# Altium schematic sheet SH22 - AIC3106.SchDoc
size 386 x 246 mm
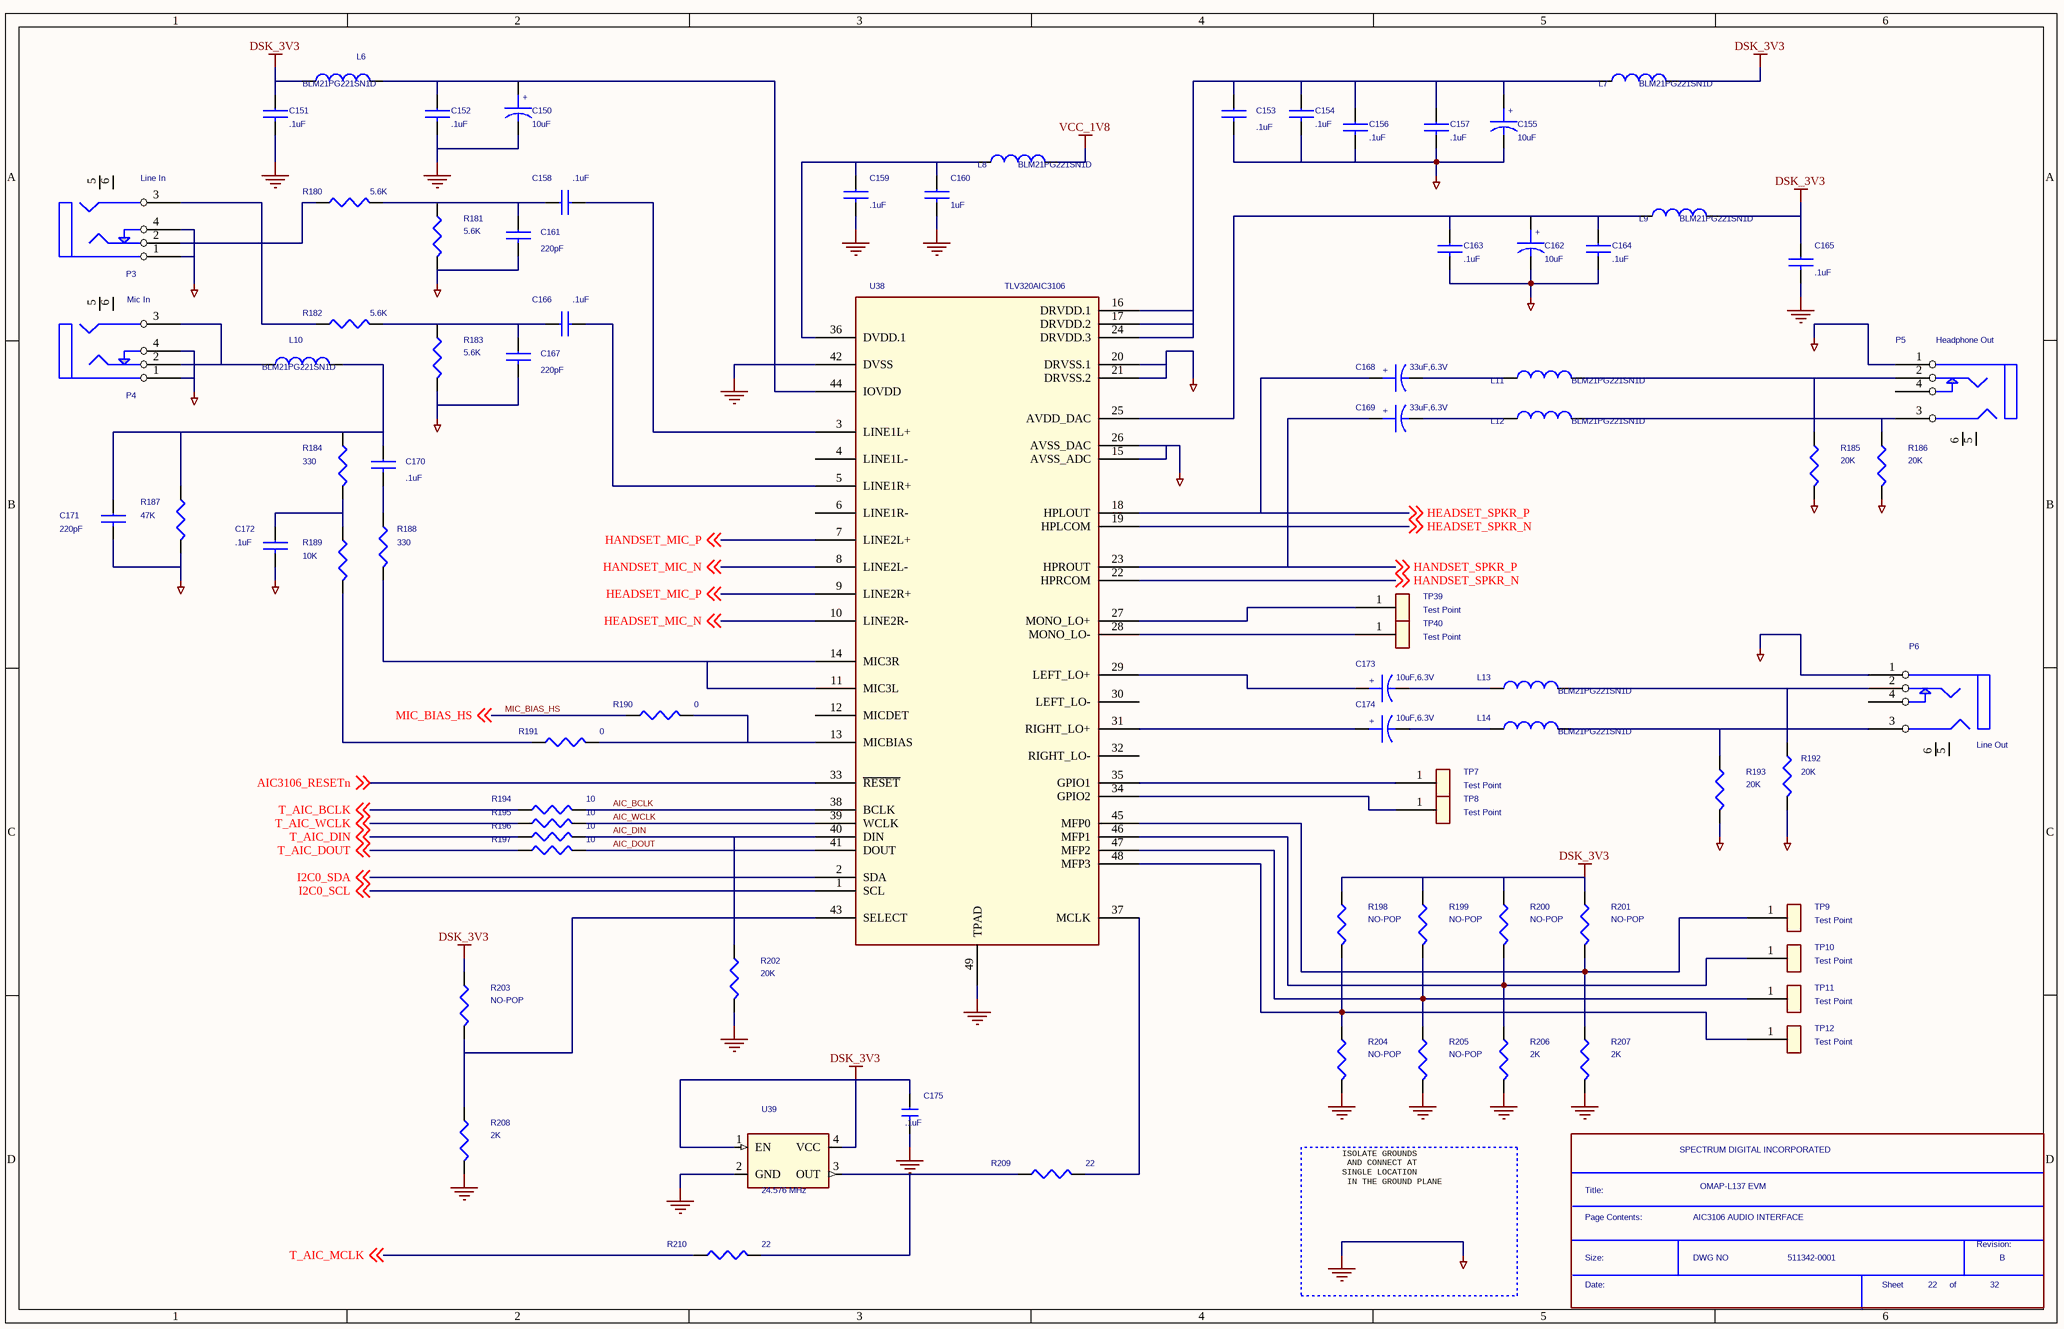
[diagram p0: SH22 - AIC3106.SchDoc]

## Parts
*  Page Contents:: AIC3106 AUDIO INTERFACE  RevCode: B  Title: OMAP-L137 EVM  OrgName: SPECTRUM DIGITAL INCORPORATED  Doc: 511342-0001  Page Number: 22  Page Count: 32  (hidden comment: SDTitleBlock)  (graphical)
C150  10uF  [c1206-40x70-POL]
C151  .1uF  [c402-25]
C152  .1uF  [c402-25]
C153  .1uF  [c402-25]
C154  .1uF  [c402-25]
C155  10uF  [c1206-40x70-POL]
C156  .1uF  [c402-25]
C157  .1uF  [c402-25]
C158  .1uF  [c402-25]
C159  .1uF  [c402-25]
C160  1uF  [c603-35x45]
C161  220pF  [c603-35x45]
C162  10uF  [c1206-40x70-POL]
C163  .1uF  [c402-25]
C164  .1uF  [c402-25]
C165  .1uF  [c402-25]
C166  .1uF  [c402-25]
C167  220pF  [c603-35x45]
C168  33uF,6.3V  [c1206-40x70p]
C169  33uF,6.3V  [c1206-40x70p]
C170  .1uF  [c402-25]
C171  220pF  [c603-35x45]
C172  .1uF  [c402-25]
C173  10uF,6.3V  [c1206-40x70-POL]
C174  10uF,6.3V  [c1206-40x70-POL]
C175  .1uF  [c402-25]
L6  BLM21PG221SN1D  [l805-35x60]
L7  BLM21PG221SN1D  [l805-35x60]
L8  BLM21PG221SN1D  [l805-35x60]
L9  BLM21PG221SN1D  [l805-35x60]
L10  BLM21PG221SN1D  [l805-35x60]
L11  BLM21PG221SN1D  [l805-35x60]
L12  BLM21PG221SN1D  [l805-35x60]
L13  BLM21PG221SN1D  [l805-35x60]
L14  BLM21PG221SN1D  [l805-35x60]
P3  Line In  [st_3500]
P4  Mic In  [st_3500]
P5  Headphone Out  [st_3500]
P6  Line Out  [st_3500]
R180  5.6K  [r603-35x45]
R181  5.6K  [r603-35x45]
R182  5.6K  [r603-35x45]
R183  5.6K  [r603-35x45]
R184  330  [r402-25]
R185  20K  [r402-25]
R186  20K  [r402-25]
R187  47K  [r402-25]
R188  330  [r402-25]
R189  10K  [r402-25]
R190  0  [r402-25]
R191  0  [r402-25]
R192  20K  [r402-25]
R193  20K  [r402-25]
R194  10  [r402-25]
R195  10  [r402-25]
R196  10  [r402-25]
R197  10  [r402-25]
R198  NO-POP  [r402-25]
R199  NO-POP  [r402-25]
R200  NO-POP  [r402-25]
R201  NO-POP  [r402-25]
R202  20K  [r402-25]
R203  NO-POP  [r402-25]
R204  NO-POP  [r402-25]
R205  NO-POP  [r402-25]
R206  2K  [r402-25]
R207  2K  [r402-25]
R208  2K  [r402-25]
R209  22  [r402-25]
R210  22  [r402-25]
TP7  Test Point  [tp1-6040]
TP8  Test Point  [tp1-6040]
TP9  Test Point  [tp1-6040]
TP10  Test Point  [tp1-6040]
TP11  Test Point  [tp1-6040]
TP12  Test Point  [tp1-6040]
TP39  Test Point  [tp1-6040]
TP40  Test Point  [tp1-6040]
U38  TLV320AIC3106  [rgz48-11x34]
U39  24.576 MHz  [xtal4-70x78-ctx]

## Nets
DSK_3V3: C151.1 C165.1 C175.1 L6.1 L7.2 L9.2 R198.1 R199.1 R200.1 R201.1 R203.1 U39.1(EN) U39.4(VCC)
GND: C150.2 C151.2 C152.2 C153.2 C154.2 C155.2 C156.2 C157.2 C159.2 C160.2 C161.2 C162.2 C163.2 C164.2 C165.2 C167.2 C171.2 C172.2 C175.2 P3.1(SHIELD) P3.4(TIPB) P4.1(SHIELD) P4.4(TIPB) P5.1(SHIELD) P6.1(SHIELD) R181.2 R183.2 R185.2 R186.2 R187.2 R192.2 R193.2 R202.2 R204.2 R205.2 R206.2 R207.2 R208.2 U38.15(AVSS_ADC) U38.20(DRVSS.1) U38.21(DRVSS.2) U38.26(AVSS_DAC) U38.42(DVSS) U38.49(TPAD) U39.2(GND)  [also labelled GND_AIC]
VCC_1V8: L8.2
AIC3106_RESETn: U38.33(~{RESET}) ; off-sheet AIC3106_RESETn
AIC_BCLK: R194.2 U38.38(BCLK)
AIC_DIN: R196.2 R202.1 U38.40(DIN)
AIC_DOUT: R197.2 U38.41(DOUT)
AIC_WCLK: R195.2 U38.39(WCLK)
HANDSET_MIC_N: U38.8(LINE2L-) ; off-sheet HANDSET_MIC_N
HANDSET_MIC_P: U38.7(LINE2L+) ; off-sheet HANDSET_MIC_P
HANDSET_SPKR_N: U38.22(HPRCOM) ; off-sheet HANDSET_SPKR_N
HANDSET_SPKR_P: C169.1 U38.23(HPROUT) ; off-sheet HANDSET_SPKR_P
HEADSET_MIC_N: U38.10(LINE2R-) ; off-sheet HEADSET_MIC_N
HEADSET_MIC_P: U38.9(LINE2R+) ; off-sheet HEADSET_MIC_P
HEADSET_SPKR_N: U38.19(HPLCOM) ; off-sheet HEADSET_SPKR_N
HEADSET_SPKR_P: C168.1 U38.18(HPLOUT) ; off-sheet HEADSET_SPKR_P
I2C0_SCL: U38.1(SCL) ; off-sheet I2C0_SCL
I2C0_SDA: U38.2(SDA) ; off-sheet I2C0_SDA
MIC_BIAS_HS: R190.1 ; off-sheet MIC_BIAS_HS
T_AIC_BCLK: R194.1 ; off-sheet T_AIC_BCLK
T_AIC_DIN: R196.1 ; off-sheet T_AIC_DIN
T_AIC_DOUT: R197.1 ; off-sheet T_AIC_DOUT
T_AIC_MCLK: R210.1 ; off-sheet T_AIC_MCLK
T_AIC_WCLK: R195.1 ; off-sheet T_AIC_WCLK
NetC150_1: C150.1 C152.1 L6.2 U38.44(IOVDD)
NetC153_1: C153.1 C154.1 C155.1 C156.1 C157.1 L7.1 U38.16(DRVDD.1) U38.17(DRVDD.2) U38.24(DRVDD.3)
NetC158_1: C158.1 C161.1 R180.2 R181.1
NetC158_2: C158.2 U38.3(LINE1L+)
NetC159_1: C159.1 C160.1 L8.1 U38.36(DVDD.1)
NetC162_1: C162.1 C163.1 C164.1 L9.1 U38.25(AVDD_DAC)
NetC166_1: C166.1 C167.1 R182.2 R183.1
NetC166_2: C166.2 U38.5(LINE1R+)
NetC168_2: C168.2 L11.1
NetC169_2: C169.2 L12.1
NetC170_1: C170.1 C171.1 L10.2 R184.1 R187.1
NetC170_2: C170.2 R188.1
NetC172_1: C172.1 R184.2 R189.1
NetC173_1: C173.1 U38.29(LEFT_LO+)
NetC173_2: C173.2 L13.1
NetC174_1: C174.1 U38.31(RIGHT_LO+)
NetC174_2: C174.2 L14.1
NetL10_1: L10.1 P4.2(TIP) P4.3(RING)
NetL11_2: L11.2 P5.2(TIP) R185.1
NetL12_2: L12.2 P5.3(RING) R186.1
NetL13_2: L13.2 P6.2(TIP) R192.1
NetL14_2: L14.2 P6.3(RING) R193.1
NetP3_2: P3.2(TIP) R180.1
NetP3_3: P3.3(RING) R182.1
NetR188_2: R188.2 U38.11(MIC3L) U38.14(MIC3R)
NetR189_2: R189.2 R191.1
NetR190_2: R190.2 R191.2 U38.13(MICBIAS)
NetR198_2: R198.2 R204.1 TP12.1 U38.48(MFP3)
NetR199_2: R199.2 R205.1 TP11.1 U38.47(MFP2)
NetR200_2: R200.2 R206.1 TP10.1 U38.46(MFP1)
NetR201_2: R201.2 R207.1 TP9.1 U38.45(MFP0)
NetR203_2: R203.2 R208.1 U38.43(SELECT)
NetR209_1: R209.1 R210.2 U39.3(OUT)
NetR209_2: R209.2 U38.37(MCLK)
NetTP7_1: TP7.1 U38.35(GPIO1)
NetTP8_1: TP8.1 U38.34(GPIO2)
NetTP39_1: TP39.1 U38.27(MONO_LO+)
NetTP40_1: TP40.1 U38.28(MONO_LO-)

Not connected (* = marked no-connect by the designer): P3 5(MH1) 6(MH2); P4 5(MH1) 6(MH2); P5 4(TIPB) 5(MH1) 6(MH2); P6 4(TIPB) 5(MH1) 6(MH2); U38 4(LINE1L-) 6(LINE1R-) 12(MICDET) 30(LEFT_LO-) 32(RIGHT_LO-)

## Notes on the sheet
- ISOLATE GROUNDS
  AND CONNECT AT
  SINGLE LOCATION
  IN THE GROUND PLANE
- (in symbol CAPACITOR POL_0) +
- (in symbol SDTitleBlock) Title:; Page Contents:; Revision:; Size:; DWG NO; Date:; Sheet; of

## Library data of the parts
C150 C155 C162 C173 C174 = CAPACITOR POL_0: Part #: 101003-0101R; Buy: D/K P#335 P2032-ND
C151-C154 C156-C159 C163-C166 C170 C172 = CAP NP: Part #: 101587-1100R
C160 = CAP NP: Part #: 101007-0100R
C161 C167 C171 = CAP NP: Part #: 100993-1223R
C168 C169 = CAPACITOR POL_0: Part #: 101953-0331R; Buy: D/K P#335 P2032-ND
C175 = CAP NP_1: Part #: 101587-1100R
L6-L14 = INDUCTOR: Part #: 101228-2201R
P3-P6 = Kycon ST-3500_0: Part #: 101012-0001R
R180-R183 = R_0: Part #: 100687-5602R
R184 R188 = R_0: Part #: 101370-3301R
R185 R186 R192 R193 R202 = R_0: Part #: 101370-2003R
R187 = R_0: Part #: 101370-4703R
R189 = R_0: Part #: 101370-1003R
R190 R191 = R_0: Part #: 101370-0001R
R194-R197 = R_0: Part #: 101370-1000R
R198-R201 R203-R205 = R_0: Part #: R0402-NOPOP
R206-R208 = R_0: Part #: 101370-2002R
R209 R210 = RESISTOR: Part #: 101370-2200R
TP7-TP12 TP39 TP40 = TEST POINT: Part #: 100115-0001R
U38 = TLV320AIC3106_0: Part #: 102800-0001R
U39 = OSC4/SM_0: Part #: 102201-2457R; SD PCB Footprint: CB3LV